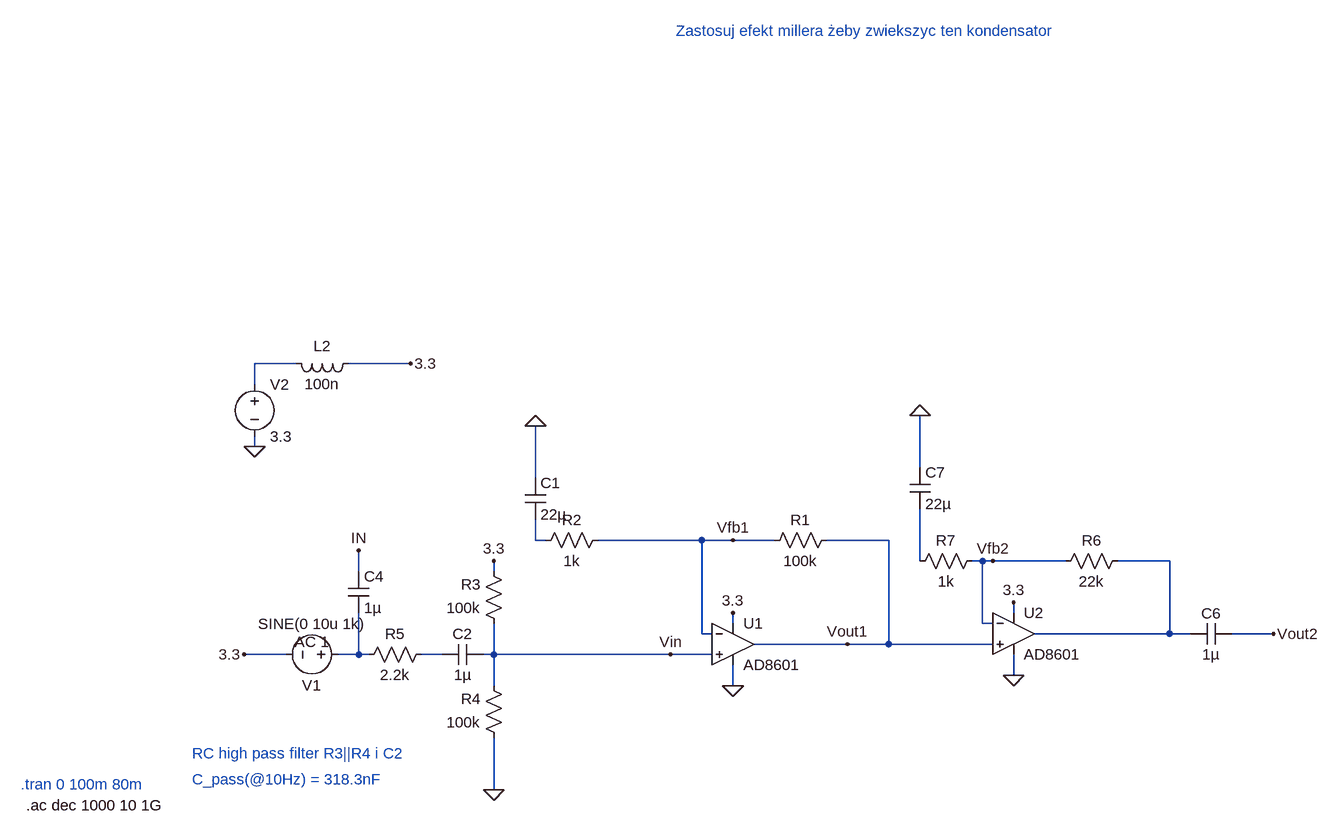
[diagram p0: schematic micAmp_cascade.asc]
micAmp_cascade.asc, the LTspice schematic file:
Version 4
SHEET 1 1668 680
WIRE -336 -288 -400 -288
WIRE -160 -288 -256 -288
WIRE -400 -256 -400 -288
WIRE -400 -160 -400 -176
WIRE 624 -128 624 -208
WIRE 32 -112 32 -192
WIRE 32 -16 32 -48
WIRE 48 -16 32 -16
WIRE 288 -16 128 -16
WIRE 336 -16 288 -16
WIRE 400 -16 336 -16
WIRE 576 -16 480 -16
WIRE 624 16 624 -64
WIRE 720 16 704 16
WIRE 736 16 720 16
WIRE 848 16 736 16
WIRE 1008 16 928 16
WIRE -240 32 -240 0
WIRE -32 32 -32 16
WIRE 768 96 768 80
WIRE 336 112 336 96
WIRE 720 112 720 16
WIRE 736 112 720 112
WIRE 288 128 288 -16
WIRE 304 128 288 128
WIRE 1008 128 1008 16
WIRE 1008 128 800 128
WIRE 1040 128 1008 128
WIRE 1168 128 1104 128
WIRE 512 144 368 144
WIRE 576 144 576 -16
WIRE 576 144 512 144
WIRE 736 144 576 144
WIRE -352 160 -416 160
WIRE -240 160 -240 96
WIRE -240 160 -272 160
WIRE -224 160 -240 160
WIRE -112 160 -144 160
WIRE -32 160 -32 112
WIRE -32 160 -48 160
WIRE 240 160 -32 160
WIRE 304 160 240 160
WIRE 768 192 768 160
WIRE -32 208 -32 160
WIRE 336 208 336 176
WIRE -32 368 -32 288
FLAG -32 368 0
FLAG -400 -160 0
FLAG -160 -288 3.3
FLAG -32 16 3.3
FLAG 336 96 3.3
FLAG 336 208 0
FLAG -416 160 3.3
FLAG -240 0 IN
FLAG 32 -192 0
FLAG 768 80 3.3
FLAG 768 192 0
FLAG 624 -208 0
FLAG 240 160 Vin
FLAG 1168 128 Vout2
FLAG 336 -16 Vfb1
FLAG 736 16 Vfb2
FLAG 512 144 Vout1
SYMBOL OpAmps\\AD8601 336 80 R0
SYMATTR InstName U1
SYMBOL res 496 -32 R90
WINDOW 0 0 56 VBottom 2
WINDOW 3 32 56 VTop 2
SYMATTR InstName R1
SYMATTR Value 100k
SYMBOL res 144 -32 R90
WINDOW 0 0 56 VBottom 2
WINDOW 3 32 56 VTop 2
SYMATTR InstName R2
SYMATTR Value 1k
SYMBOL res -16 128 R180
WINDOW 0 36 76 Left 2
WINDOW 3 36 40 Left 2
SYMATTR InstName R3
SYMATTR Value 100k
SYMBOL res -16 304 R180
WINDOW 0 36 76 Left 2
WINDOW 3 36 40 Left 2
SYMATTR InstName R4
SYMATTR Value 100k
SYMBOL voltage -400 -272 R0
WINDOW 123 0 0 Left 0
WINDOW 39 0 0 Left 0
SYMATTR InstName V2
SYMATTR Value 3.3
SYMBOL ind -240 -304 R90
WINDOW 0 5 56 VBottom 2
WINDOW 3 32 56 VTop 2
SYMATTR InstName L2
SYMATTR Value 100n
SYMBOL cap -48 144 R90
WINDOW 0 0 32 VBottom 2
WINDOW 3 32 32 VTop 2
SYMATTR InstName C2
SYMATTR Value 1µ
SYMBOL res -240 176 R270
WINDOW 0 32 56 VTop 2
WINDOW 3 0 56 VBottom 2
SYMATTR InstName R5
SYMATTR Value 2.2k
SYMBOL cap -256 32 R0
SYMATTR InstName C4
SYMATTR Value 1µ
SYMBOL cap 16 -112 R0
SYMATTR InstName C1
SYMATTR Value 22µ
SYMBOL OpAmps\\AD8601 768 64 R0
SYMATTR InstName U2
SYMBOL res 944 0 R90
WINDOW 0 0 56 VBottom 2
WINDOW 3 32 56 VTop 2
SYMATTR InstName R6
SYMATTR Value 22k
SYMBOL res 720 0 R90
WINDOW 0 0 56 VBottom 2
WINDOW 3 32 56 VTop 2
SYMATTR InstName R7
SYMATTR Value 1k
SYMBOL cap 1104 112 R90
WINDOW 0 0 32 VBottom 2
WINDOW 3 32 32 VTop 2
SYMATTR InstName C6
SYMATTR Value 1µ
SYMBOL cap 608 -128 R0
SYMATTR InstName C7
SYMATTR Value 22µ
SYMBOL voltage -256 160 R90
WINDOW 0 32 56 VTop 2
WINDOW 3 -32 56 VBottom 2
WINDOW 123 -4 56 VBottom 2
WINDOW 39 0 0 Left 0
SYMATTR InstName V1
SYMATTR Value SINE(0 10u 1k)
SYMATTR Value2 AC 1
TEXT -760 360 Left 2 ;.tran 0 100m 80m
TEXT -752 392 Left 2 !.ac dec 1000 10 1G
TEXT -496 312 Left 2 ;RC high pass filter R3||R4 i C2
TEXT -496 352 Left 2 ;C_pass(@10Hz) = 318.3nF
TEXT 248 -800 Left 2 ;Zastosuj efekt millera żeby zwiekszyc ten kondensator

The netlist it stands for:
* micAmp_cascade.asc
XU1 Vin Vfb1 3.3 0 Vout1 AD8601  ; pins In+ In- V+ V- OUT
R1 Vout1 Vfb1 100k
R2 Vfb1 N002 1k
R3 Vin 3.3 100k
R4 0 Vin 100k
V2 N001 0 3.3
L2 3.3 N001 100n
C2 Vin N006 1µ
R5 N005 N006 2.2k
C4 IN N005 1µ
C1 0 N002 22µ
XU2 Vout1 Vfb2 3.3 0 N004 AD8601  ; pins In+ In- V+ V- OUT
R6 N004 Vfb2 22k
R7 Vfb2 N003 1k
C6 Vout2 N004 1µ
C7 0 N003 22µ
V1 N005 3.3 SINE(0 10u 1k) AC 1
* .tran 0 100m 80m
.ac dec 1000 10 1G
* RC high pass filter R3||R4 i C2
* C_pass(@10Hz) = 318.3nF
* Zastosuj efekt millera żeby zwiekszyc ten kondensator
.backanno
.end